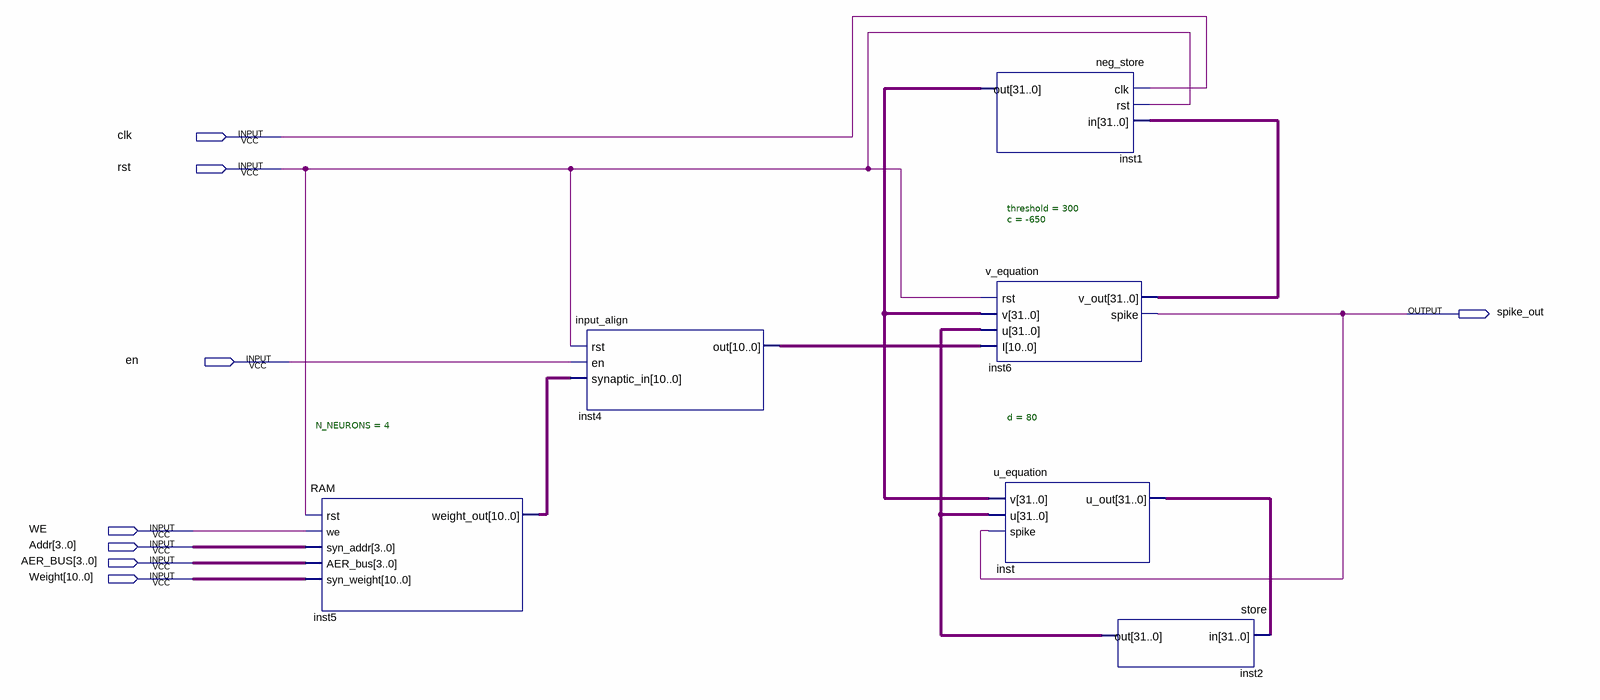
[diagram p0: schematic sheet]
// Quartus schematic izhneuron.bdf as structural Verilog: 6 symbols, 8 pins
module izhneuron (
  input  clk,
  input  rst,
  input  en,
  input  WE,
  input  [3:0] Addr,
  input  [3:0] AER_BUS,
  input  [10:0] Weight,
  output spike_out
);

  wire [10:0] inst4_out, inst5_weight_out;
  wire [31:0] inst1_out, inst2_out, inst6_v_out, inst_u_out;

  RAM #(.N_NEURONS(4)) inst5 (
    .rst(rst), .we(WE), .syn_addr(Addr), .AER_bus(AER_BUS), .syn_weight(Weight), .weight_out(inst5_weight_out));
  input_align inst4 (.rst(rst), .en(en), .synaptic_in(inst5_weight_out), .out(inst4_out));
  neg_store inst1 (.clk(clk), .rst(rst), .in(inst6_v_out), .out(inst1_out));
  v_equation #(.threshold(300), .c(-650)) inst6 (
    .rst(rst), .v(inst1_out), .u(inst2_out), .I(inst4_out), .v_out(inst6_v_out), .spike(spike_out));
  u_equation #(.d(80)) inst (.v(inst1_out), .u(inst2_out), .spike(spike_out), .u_out(inst_u_out));
  store inst2 (.in(inst_u_out), .out(inst2_out));
endmodule
